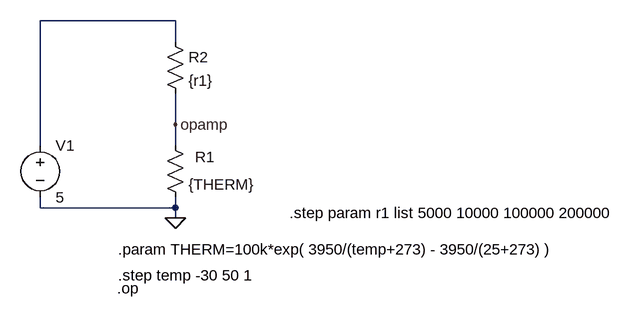
[diagram p0: schematic spice_simulation.asc]
spice_simulation.asc, the LTspice schematic file:
Version 4
SHEET 1 1476 680
WIRE 112 -96 -96 -96
WIRE 112 -64 112 -96
WIRE 112 64 112 16
WIRE -96 96 -96 -96
WIRE 112 96 112 64
WIRE -96 192 -96 176
WIRE 112 192 112 176
WIRE 112 192 -96 192
WIRE 112 208 112 192
FLAG 112 208 0
FLAG 112 64 opamp
SYMBOL res 96 80 R0
WINDOW 0 46 34 Left 2
SYMATTR InstName R1
SYMATTR Value {THERM}
SYMBOL voltage -96 80 R0
WINDOW 123 0 0 Left 2
WINDOW 39 0 0 Left 2
SYMATTR InstName V1
SYMATTR Value 5
SYMBOL res 96 -80 R0
SYMATTR InstName R2
SYMATTR Value {r1}
TEXT 24 256 Left 2 !.param THERM=100k*exp( 3950/(temp+273) - 3950/(25+273) )
TEXT 24 296 Left 2 !.step temp -30 50 1
TEXT 22 316 Left 2 !.op
TEXT 288 200 Left 2 !.step param r1 list 5000 10000 100000 200000

The netlist it stands for:
* spice_simulation.asc
R1 opamp 0 {THERM}
V1 N001 0 5
R2 N001 opamp {r1}
.param THERM=100k*exp( 3950/(temp+273) - 3950/(25+273) )
.step temp -30 50 1
.op
.step param r1 list 5000 10000 100000 200000
.backanno
.end